# EAGLE design S205X (EAGLE 6.6.0)
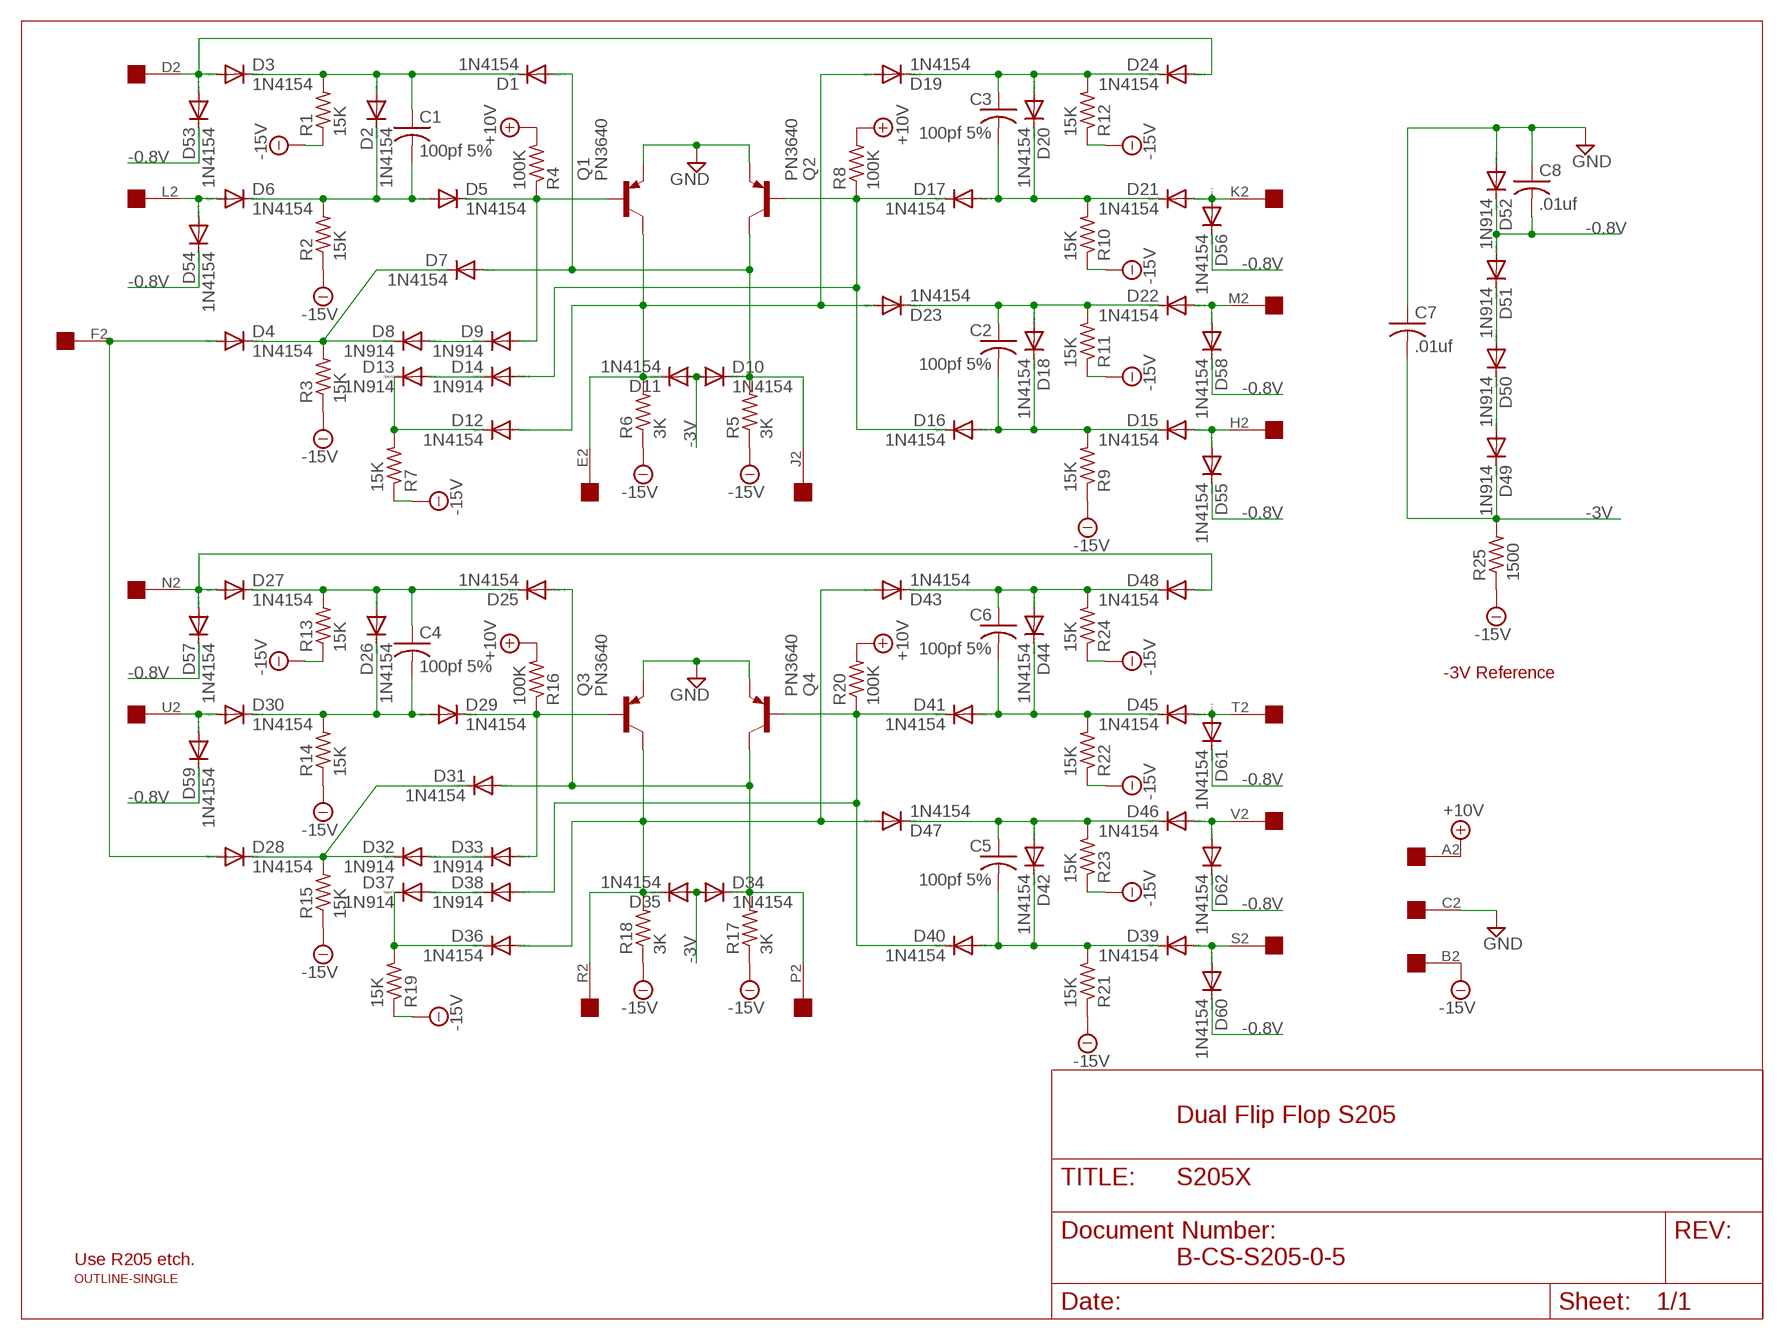
[diagram p0: schematic, sheet 1]

## Parts
C1  100pf 5%  C-US050-025X075  [C050-025X075]
C2  100pf 5%  C-US050-025X075  [C050-025X075]
C3  100pf 5%  C-US050-025X075  [C050-025X075]
C4  100pf 5%  C-US050-025X075  [C050-025X075]
C5  100pf 5%  C-US050-025X075  [C050-025X075]
C6  100pf 5%  C-US050-025X075  [C050-025X075]
C7  .01uf  C-US050-025X075  [C050-025X075]
C8  .01uf  C-US050-025X075  [C050-025X075]
D1  1N4154  1N4148DO35-10  [DO35-10]
D2  1N4154  1N4148DO35-10  [DO35-10]
D3  1N4154  1N4148DO35-10  [DO35-10]
D4  1N4154  1N4148DO35-10  [DO35-10]
D5  1N4154  1N4148DO35-10  [DO35-10]
D6  1N4154  1N4148DO35-10  [DO35-10]
D7  1N4154  1N4148DO35-10  [DO35-10]
D8  1N914  1N4148DO35-10  [DO35-10]
D9  1N914  1N4148DO35-10  [DO35-10]
D10  1N4154  1N4148DO35-10  [DO35-10]
D11  1N4154  1N4148DO35-10  [DO35-10]
D12  1N4154  1N4148DO35-10  [DO35-10]
D13  1N914  1N4148DO35-10  [DO35-10]
D14  1N914  1N4148DO35-10  [DO35-10]
D15  1N4154  1N4148DO35-10  [DO35-10]
D16  1N4154  1N4148DO35-10  [DO35-10]
D17  1N4154  1N4148DO35-10  [DO35-10]
D18  1N4154  1N4148DO35-10  [DO35-10]
D19  1N4154  1N4148DO35-10  [DO35-10]
D20  1N4154  1N4148DO35-10  [DO35-10]
D21  1N4154  1N4148DO35-10  [DO35-10]
D22  1N4154  1N4148DO35-10  [DO35-10]
D23  1N4154  1N4148DO35-10  [DO35-10]
D24  1N4154  1N4148DO35-10  [DO35-10]
D25  1N4154  1N4148DO35-10  [DO35-10]
D26  1N4154  1N4148DO35-10  [DO35-10]
D27  1N4154  1N4148DO35-10  [DO35-10]
D28  1N4154  1N4148DO35-10  [DO35-10]
D29  1N4154  1N4148DO35-10  [DO35-10]
D30  1N4154  1N4148DO35-10  [DO35-10]
D31  1N4154  1N4148DO35-10  [DO35-10]
D32  1N914  1N4148DO35-10  [DO35-10]
D33  1N914  1N4148DO35-10  [DO35-10]
D34  1N4154  1N4148DO35-10  [DO35-10]
D35  1N4154  1N4148DO35-10  [DO35-10]
D36  1N4154  1N4148DO35-10  [DO35-10]
D37  1N914  1N4148DO35-10  [DO35-10]
D38  1N914  1N4148DO35-10  [DO35-10]
D39  1N4154  1N4148DO35-10  [DO35-10]
D40  1N4154  1N4148DO35-10  [DO35-10]
D41  1N4154  1N4148DO35-10  [DO35-10]
D42  1N4154  1N4148DO35-10  [DO35-10]
D43  1N4154  1N4148DO35-10  [DO35-10]
D44  1N4154  1N4148DO35-10  [DO35-10]
D45  1N4154  1N4148DO35-10  [DO35-10]
D46  1N4154  1N4148DO35-10  [DO35-10]
D47  1N4154  1N4148DO35-10  [DO35-10]
D48  1N4154  1N4148DO35-10  [DO35-10]
D49  1N914  1N4148DO35-10  [DO35-10]
D50  1N914  1N4148DO35-10  [DO35-10]
D51  1N914  1N4148DO35-10  [DO35-10]
D52  1N914  1N4148DO35-10  [DO35-10]
D53  1N4154  1N4148DO35-10  [DO35-10]
D54  1N4154  1N4148DO35-10  [DO35-10]
D55  1N4154  1N4148DO35-10  [DO35-10]
D56  1N4154  1N4148DO35-10  [DO35-10]
D57  1N4154  1N4148DO35-10  [DO35-10]
D58  1N4154  1N4148DO35-10  [DO35-10]
D59  1N4154  1N4148DO35-10  [DO35-10]
D60  1N4154  1N4148DO35-10  [DO35-10]
D61  1N4154  1N4148DO35-10  [DO35-10]
D62  1N4154  1N4148DO35-10  [DO35-10]
Q1  PN3640  2N3637  [TO39]
Q2  PN3640  2N3637  [TO39]
Q3  PN3640  2N3637  [TO39]
Q4  PN3640  2N3637  [TO39]
R1  15K  R-US_0207/10  [0207/10]
R2  15K  R-US_0207/10  [0207/10]
R3  15K  R-US_0207/10  [0207/10]
R4  100K  R-US_0207/10  [0207/10]
R5  3K  R-US_0207/10  [0207/10]
R6  3K  R-US_0207/10  [0207/10]
R7  15K  R-US_0207/10  [0207/10]
R8  100K  R-US_0207/10  [0207/10]
R9  15K  R-US_0207/10  [0207/10]
R10  15K  R-US_0207/10  [0207/10]
R11  15K  R-US_0207/10  [0207/10]
R12  15K  R-US_0207/10  [0207/10]
R13  15K  R-US_0207/10  [0207/10]
R14  15K  R-US_0207/10  [0207/10]
R15  15K  R-US_0207/10  [0207/10]
R16  100K  R-US_0207/10  [0207/10]
R17  3K  R-US_0207/10  [0207/10]
R18  3K  R-US_0207/10  [0207/10]
R19  15K  R-US_0207/10  [0207/10]
R20  100K  R-US_0207/10  [0207/10]
R21  15K  R-US_0207/10  [0207/10]
R22  15K  R-US_0207/10  [0207/10]
R23  15K  R-US_0207/10  [0207/10]
R24  15K  R-US_0207/10  [0207/10]
R25  1500  R-US_0207/10  [0207/10]
U$1  OUTLINE-SINGLE  [SINGLE]
U$2  EDGE-1  [EDGE-CON1]

## Nets
+10V [Power]: R4.2 R8.2 R16.2 R20.2 U$2.A2
-0.8V [Power]: C8.2 D51.A D52.C D53.C D54.C D55.C D56.C D57.C D58.C D59.C D60.C D61.C D62.C
-3V [Power]: C7.2 D10.A D11.A D34.A D35.A D49.C R25.2
-15V [Power]: R1.1 R2.1 R3.1 R5.1 R6.1 R7.1 R9.1 R10.1 R11.1 R12.1 R13.1 R14.1 R15.1 R17.1 R18.1 R19.1 R21.1 R22.1 R23.1 R24.1 R25.1 U$2.B2
E: D11.C D12.A D19.A D23.A Q1.3(C) R6.2 U$2.E2
GND [Power]: C7.1 C8.1 D52.A Q1.1(E) Q2.1(E) Q3.1(E) Q4.1(E) U$2.C2
J: D1.A D7.A D10.C Q2.3(C) R5.2 U$2.J2
N$1: C4.1 D25.C D26.A D27.C R13.2
N$2: C3.1 D19.C D20.A D24.C R12.2
N$3: C1.2 D2.C D5.A D6.C R2.2
N$4: D3.A D24.A D53.A U$2.D2
N$5: D6.A D54.A U$2.L2
N$6: D13.A D14.C
N$7: D32.A D33.C
N$8: C3.2 D17.A D20.C D21.C R10.2
N$9: D4.C D7.C D8.C R3.2
N$10: D4.A D28.A U$2.F2
N$11: D21.A D56.A U$2.K2
N$12: D12.C D13.C R7.2
N$13: D50.A D51.C
N$14: D5.C D9.A Q1.2(B) R4.1
N$15: C4.2 D26.C D29.A D30.C R14.2
N$16: D49.A D50.C
N$17: D14.A D16.C D17.C Q2.2(B) R8.1
N$18: D30.A D59.A U$2.U2
N$19: D28.C D31.C D32.C R15.2
N$21: D29.C D33.A Q3.2(B) R16.1
N$22: C1.1 D1.C D2.A D3.C R1.2
N$23: D8.A D9.C
N$24: C6.1 D43.C D44.A D48.C R24.2
N$25: D37.A D38.C
N$26: C6.2 D41.A D44.C D45.C R22.2
N$27: D45.A D61.A U$2.T2
N$28: C2.1 D18.A D22.C D23.C R11.2
N$29: D38.A D40.C D41.C Q4.2(B) R20.1
N$30: D22.A D58.A U$2.M2
N$31: C2.2 D15.C D16.A D18.C R9.2
N$32: D15.A D55.A U$2.H2
N$33: D36.C D37.C R19.2
N$34: C5.1 D42.A D46.C D47.C R23.2
N$35: D46.A D62.A U$2.V2
N$36: C5.2 D39.C D40.A D42.C R21.2
N$37: D39.A D60.A U$2.S2
N$38: D27.A D48.A D57.A U$2.N2
P: D25.A D31.A D34.C Q4.3(C) R17.2 U$2.P2
R: D35.C D36.A D43.A D47.A Q3.3(C) R18.2 U$2.R2

## Notes on the sheet
- -3V Reference
- Dual Flip Flop S205
- Use R205 etch. | B-CS-S205-0-5

## Library data of the parts
C1-C8 = rcl:C-US: CAPACITOR, American symbol
D1-D62 = diode:1N4148: DIODE high speed (Philips)
Q1-Q4 = transistor-pnp:2N3637*: PNP Transistror
R1-R25 = rcl:R-US_: RESISTOR, American symbol
U$1 = dec-con:OUTLINE-*: Board outlines for DEC boards.
U$2 = dec-con:EDGE-1: Single-Sided DEC Edge Connector -- (side 2)

## Net classes
1 Power: width 0.813 mm

## Board
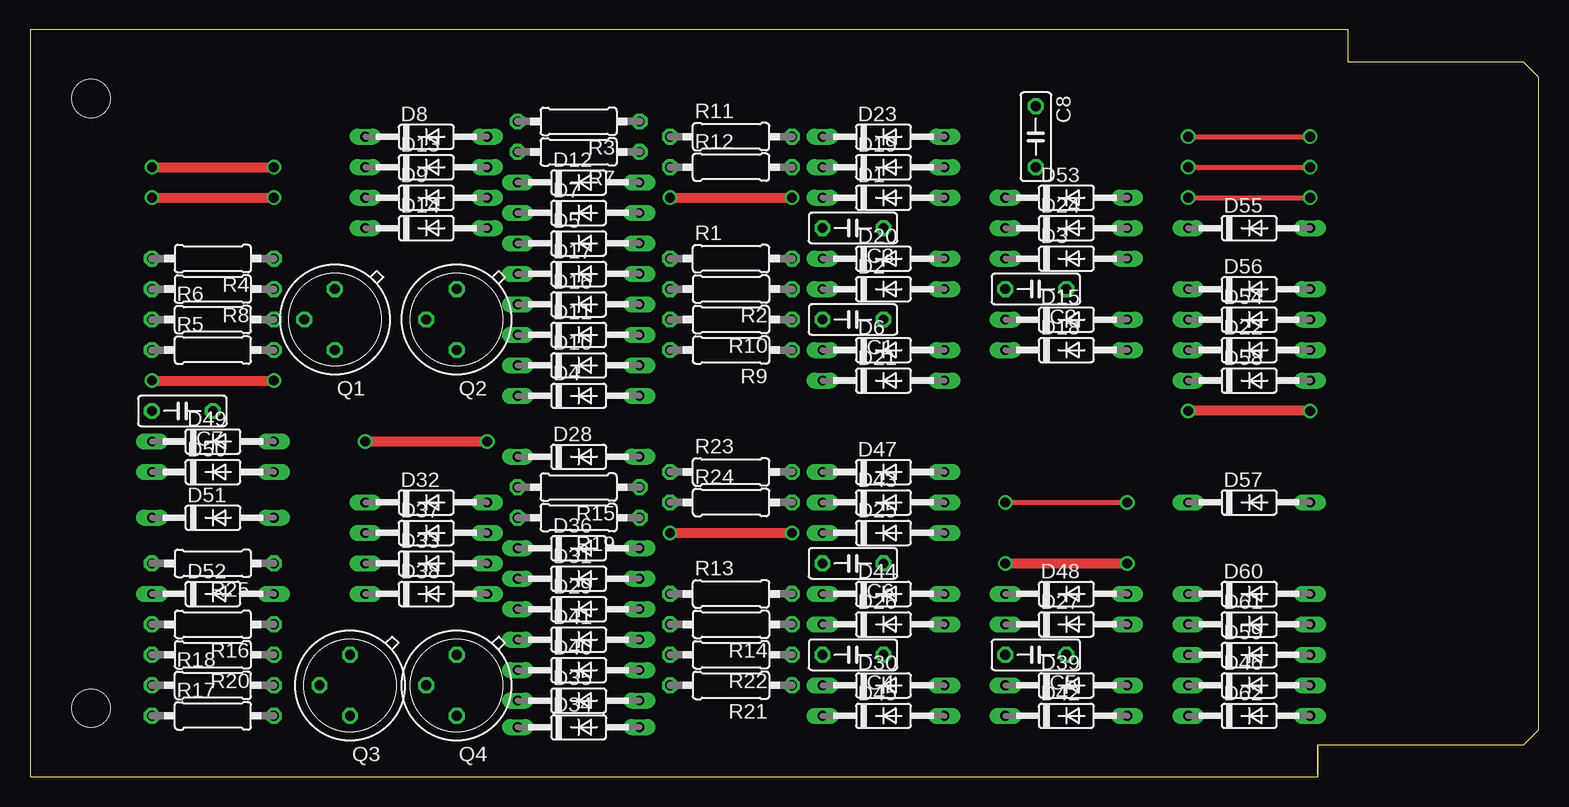
[diagram p1: board, top side]
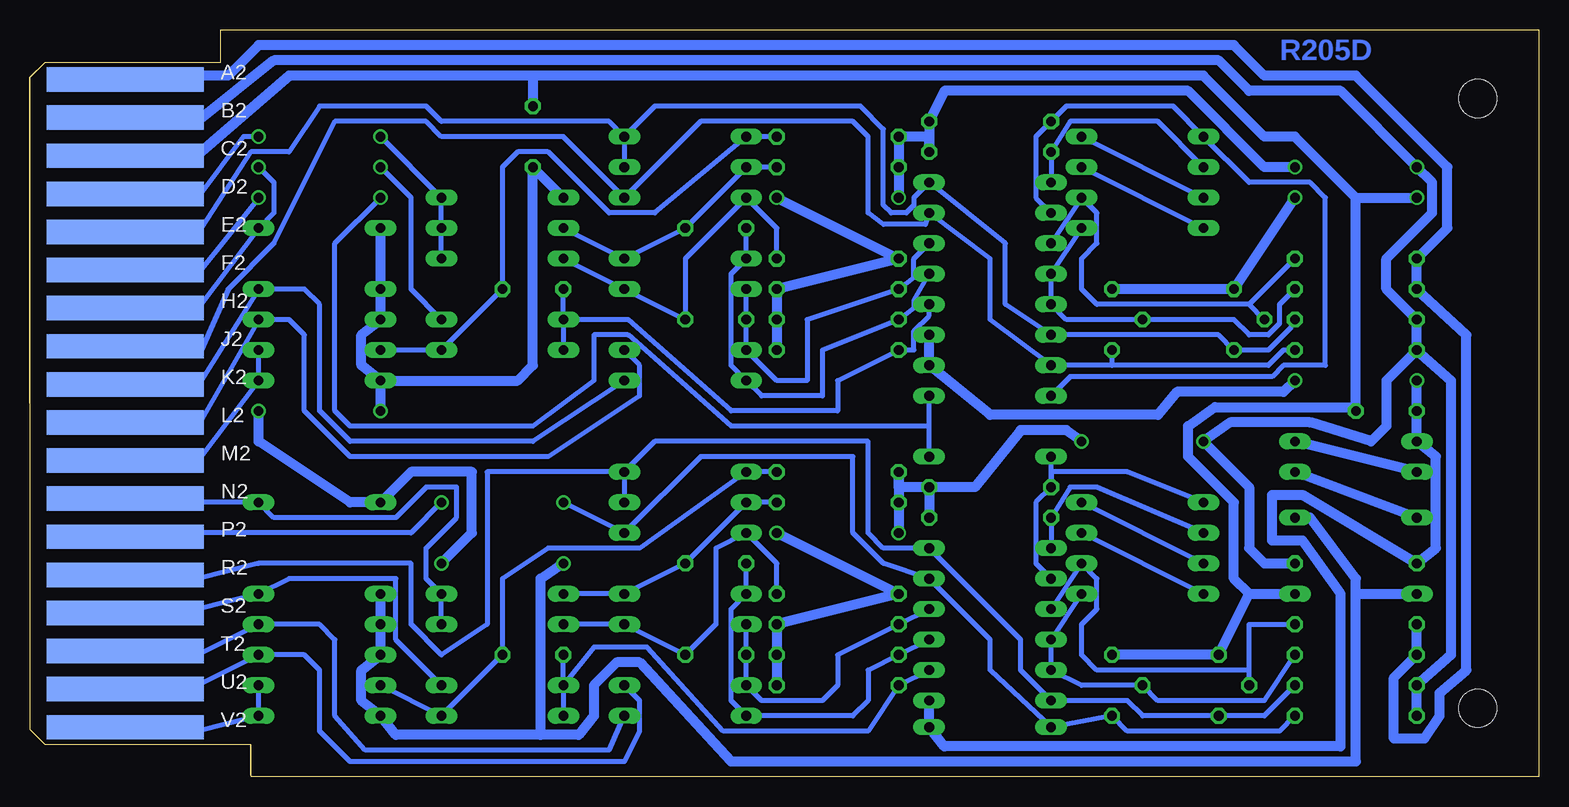
[diagram p2: board, bottom side, seen from below]

Size 125.73 x 62.23 mm. Coordinates in mm from the lower left corner, seen from the top.
Copper layers (1+16): Top 0.035mm / dielectric 1.5mm / Bottom 0.035mm
Design rules "16mils": minimum track width 16mil, minimum drill 32mil, track to track 15mil, track to pad 10mil, pad to pad 10mil, via to via 10mil, smd to smd 10mil, copper to edge 13mil, drill to drill 10mil, minimum pad ring 10mil, minimum via ring 8mil, stop-mask expansion 0mil, vias tented up to drill 0mil, thermal gap 10mil

### Footprints (pad centres in the part's own frame; a part is rotated, then mirrored left to right if it is on the bottom)
C050-025X075 = drill 0.813 octagon: 1 -2.54,0; 2 2.54,0
DO35-10 = drill 0.813 long: A 5.08,0; C -5.08,0
TO39 = drill 0.813 octagon: 1 0,-2.54; 2 2.54,0; 3 0,2.54
0207/10 = drill 0.813 octagon: 1 -5.08,0; 2 5.08,0
SINGLE = hole 3.175: 120.65,56.515; 120.65,5.715
EDGE-CON1 = smd 13.106 x 2.032 bottom: A2 7.938,4.128; B2 7.938,7.303; C2 7.938,10.477; D2 7.938,13.652; E2 7.938,16.828; F2 7.938,20.003; H2 7.938,23.177; J2 7.938,26.352; K2 7.938,29.527; L2 7.938,32.703; M2 7.938,35.877; N2 7.938,39.053; P2 7.938,42.227; R2 7.938,45.403; S2 7.938,48.578; T2 7.938,51.752; U2 7.938,54.928; V2 7.938,58.102

### Placement (x,y rotation side)
C1  68.58,38.1 180 top
C2  83.82,40.64 180 top
C3  68.58,45.72 180 top
C4  68.58,10.16 180 top
C5  83.82,10.16 180 top
C6  68.58,17.78 180 top
C7  12.7,30.48 180 top
C8  83.82,53.34 270 top
D1  71.12,48.26 0 top
D2  71.12,40.64 0 top
D3  86.36,43.18 0 top
D4  45.72,31.75 0 top
D5  45.72,44.45 0 top
D6  71.12,35.56 0 top
D7  45.72,46.99 0 top
D8  33.02,53.34 0 top
D9  33.02,48.26 0 top
D10  45.72,34.29 0 top
D11  45.72,36.83 0 top
D12  45.72,49.53 0 top
D13  33.02,50.8 0 top
D14  33.02,45.72 0 top
D15  86.36,38.1 0 top
D16  45.72,39.37 0 top
D17  45.72,41.91 0 top
D18  86.36,35.56 0 top
D19  71.12,50.8 0 top
D20  71.12,43.18 0 top
D21  71.12,33.02 0 top
D22  101.6,35.56 0 top
D23  71.12,53.34 0 top
D24  86.36,45.72 0 top
D25  71.12,20.32 0 top
D26  71.12,12.7 0 top
D27  86.36,12.7 0 top
D28  45.72,26.67 0 top
D29  45.72,13.97 0 top
D30  71.12,7.62 0 top
D31  45.72,16.51 0 top
D32  33.02,22.86 0 top
D33  33.02,17.78 0 top
D34  45.72,4.13 0 top
D35  45.72,6.35 0 top
D36  45.72,19.05 0 top
D37  33.02,20.32 0 top
D38  33.02,15.24 0 top
D39  86.36,7.62 0 top
D40  45.72,8.89 0 top
D41  45.72,11.43 0 top
D42  86.36,5.08 0 top
D43  71.12,22.86 0 top
D44  71.12,15.24 0 top
D45  71.12,5.08 0 top
D46  101.6,7.62 0 top
D47  71.12,25.4 0 top
D48  86.36,15.24 0 top
D49  15.24,27.94 0 top
D50  15.24,25.4 0 top
D51  15.24,21.59 0 top
D52  15.24,15.24 0 top
D53  86.36,48.26 0 top
D54  101.6,38.1 0 top
D55  101.6,45.72 0 top
D56  101.6,40.64 0 top
D57  101.6,22.86 0 top
D58  101.6,33.02 0 top
D59  101.6,10.16 0 top
D60  101.6,15.24 0 top
D61  101.6,12.7 0 top
D62  101.6,5.08 0 top
Q1  25.4,38.1 180 top
Q2  35.56,38.1 180 top
Q3  26.67,7.62 180 top
Q4  35.56,7.62 180 top
R1  58.42,43.18 0 top
R2  58.42,40.64 180 top
R3  45.72,54.61 180 top
R4  15.24,43.18 180 top
R5  15.24,35.56 0 top
R6  15.24,38.1 0 top
R7  45.72,52.07 180 top
R8  15.24,40.64 180 top
R9  58.42,35.56 180 top
R10  58.42,38.1 180 top
R11  58.42,53.34 0 top
R12  58.42,50.8 0 top
R13  58.42,15.24 0 top
R14  58.42,12.7 180 top
R15  45.72,24.13 180 top
R16  15.24,12.7 180 top
R17  15.24,5.08 0 top
R18  15.24,7.62 0 top
R19  45.72,21.59 180 top
R20  15.24,10.16 180 top
R21  58.42,7.62 180 top
R22  58.42,10.16 180 top
R23  58.42,25.4 0 top
R24  58.42,22.86 0 top
R25  15.24,17.78 180 top
U$1  125.73,62.23 180 top
U$2  125.73,62.23 180 top

### Tracks (layer width: path | path; a pad name or v marks a point on that pad's centre or on a via)
+10V
  Bottom 0.813: R16.2 R20.2 12.06,8.26 12.06,3.17 9.53,3.17 8.26,5.08 8.26,6.99 6.03,8.89 6.03,36.83 R8.2 R4.2 7.62,45.72 7.62,50.8 15.24,58.42 22.86,58.42 25.4,60.96 106.68,60.96 109.22,58.42 111.76,58.42 U$2.A2
-0.8V  (via drill 0.81)
  Top 0.813: v81.28,17.78 v91.44,17.78 | v106.68,30.48 v96.52,30.48
  Bottom 0.813: D60.C D61.C D59.C 98.11,8.89 98.11,6.35 D62.C 95.25,3.49 83.19,3.49 | 83.19,3.49 80.01,3.49 78.74,5.08 78.74,7.62 76.83,9.53 74.93,9.53 67.31,1.27 15.24,1.27 15.24,15.24 | v91.44,17.78 88.9,20.32 88.9,25.4 93.98,25.4 D57.C 99.06,22.86 106.68,27.94 v106.68,30.48 | 83.19,3.49 83.19,16.51 v81.28,17.78 | 15.24,15.24 D52.C | D51.A 19.05,21.59 15.24,16.51 15.24,15.24 | D53.C C8.2 83.82,34.29 85.09,33.02 D58.C | v96.52,30.48 D58.C | D58.C 98.11,34.29 98.11,36.83 D54.C D56.C D55.C
-3V  (via drill 0.81)
  Top 0.813: v10.16,33.02 v20.32,33.02
  Bottom 0.813: D35.A D34.A 49.53,2.54 16.51,2.54 16.51,15.24 19.68,19.68 22.23,19.68 22.23,23.5 19.68,23.5 R25.2 8.57,19.05 8.57,26.67 D49.C C7.2 v10.16,33.02 | D11.A D10.A 45.72,30.16 31.75,30.16 30.16,32.07 21.27,32.07 v20.32,33.02
-15V  (via drill 0.81)
  Top 0.813: v53.34,20.32 v63.5,20.32 | v27.94,27.94 v38.1,27.94 | v10.16,50.8 v20.32,50.8 | v53.34,48.26 v63.5,48.26
  Bottom 0.813: R21.1 R22.1 R14.1 R13.1 v63.5,20.32 | v53.34,20.32 R24.1 R23.1 53.34,24.13 R15.1 | R15.1 R19.1 | R17.1 R18.1 7.3,10.16 7.3,33.02 R5.1 | R15.1 46.99,24.13 43.18,28.89 39.37,28.89 v38.1,27.94 | R25.1 22.86,17.78 24.13,19.05 24.13,24.13 v27.94,27.94 25.72,29.53 19.05,29.53 13.97,27.94 12.7,29.21 12.7,33.02 R5.1 | U$2.B2 111.76,54.61 105.41,59.69 26.67,59.69 24.13,57.15 16.51,57.15 v10.16,50.8 8.89,49.53 8.89,46.99 12.7,43.18 12.7,40.64 R6.1 R5.1 | v53.34,48.26 R12.1 R11.1 50.8,53.34 R7.1 R3.1 49.53,57.15 29.21,57.15 22.86,50.8 v20.32,50.8 | v63.5,48.26 R1.1 R2.1 R10.1 R9.1
E
  Bottom 0.406: U$2.E2 111.44,45.72 107.31,52.07 104.14,52.07 101.6,55.88 92.71,55.88 91.44,54.61 77.47,54.61 D23.A | D23.A D19.A | D23.A 73.66,55.88 56.52,55.88 54.61,53.98 54.61,47.62 53.98,46.99 52.7,46.99 52.07,47.62 52.07,48.26 D12.A 44.45,44.45 44.45,39.37 D11.C 26.67,36.83 Q1.3 22.54,35.56 20.64,37.47 20.64,38.1 R6.2
GND  (via drill 0.81)
  Top 0.813: v10.16,48.26 v20.32,48.26
  Bottom 0.813: 24.13,15.24 D52.A | 24.13,15.24 Q3.1 Q4.1 | U$2.C2 111.44,52.07 104.14,58.42 83.82,58.42 | 83.82,58.42 27.94,58.42 22.86,53.34 20.32,53.34 15.24,48.26 | 83.82,58.42 C8.1 | 24.13,15.24 25.4,16.51 25.4,22.86 29.21,26.67 29.21,29.21 26.99,30.8 15.24,30.8 C7.1 15.24,48.26 | 15.24,48.26 v10.16,48.26 | Q2.1 Q1.1 v20.32,48.26
J
  Bottom 0.406: U$2.J2 111.44,35.56 109.22,40.64 105.41,44.45 100.33,54.61 92.71,54.61 91.44,53.34 81.28,53.34 D1.A 69.85,54.61 57.15,54.61 55.88,53.34 55.88,46.99 54.61,46.04 51.12,46.04 D7.A 45.72,43.18 45.72,38.1 D10.C 35.56,34.29 | R5.2 21.27,35.56 22.54,34.29 35.56,34.29 | 35.56,34.29 Q2.3
N$1
  Bottom 0.406: D27.C D26.A C4.1 68.58,12.7 68.58,19.05 D25.C 63.5,17.78 R13.2
N$2
  Bottom 0.406: D24.C D20.A C3.1 D19.C R12.2
N$3
  Bottom 0.406: D2.C C1.2 D6.C 63.5,33.02 60.96,33.02 60.96,38.1 R2.2 52.07,41.59 52.07,43.18 D5.A
N$4  (via drill 0.81)
  Top 0.406: v96.52,53.34 v106.68,53.34
  Bottom 0.406: U$2.D2 111.76,48.26 107.95,53.34 v106.68,53.34 | v96.52,53.34 D53.A D24.A D3.A
N$5
  Bottom 0.406: U$2.L2 111.76,29.21 D54.A 104.14,38.1 102.87,36.83 102.87,30.48 99.06,26.67 82.55,26.67 74.93,31.75 74.93,34.29 D6.A
N$6
  Bottom 0.406: D14.C D13.A
N$7
  Bottom 0.406: D33.C D32.A
N$8
  Bottom 0.406: C3.2 D20.C 67.31,41.91 67.31,34.29 D21.C 64.77,31.75 59.69,31.75 59.69,35.56 R10.2 52.07,39.05 52.07,39.69 D17.A
N$9
  Bottom 0.406: D7.C 41.91,48.26 41.91,53.34 R3.2 39.37,55.88 30.48,55.88 D8.C 24.13,49.53 19.05,49.53 17.78,48.26 17.78,34.29 21.27,34.29 22.23,33.34 39.05,33.34 D4.C
N$10  (via drill 0.81)
  Top 0.406: v96.52,48.26 v106.68,48.26
  Bottom 0.406: U$2.F2 111.76,41.91 v106.68,48.26 | v96.52,48.26 100.33,44.45 100.33,30.48 99.06,29.21 83.82,29.21 78.74,33.02 78.74,36.83 75.88,36.83 67.31,29.21 50.8,29.21 | D28.A 50.8,29.21 | 50.8,29.21 D4.A
N$11
  Bottom 0.406: U$2.K2 111.44,33.02 D56.A 102.87,40.64 101.6,39.37 101.6,30.48 99.06,27.94 83.82,27.94 D21.A
N$12
  Bottom 0.406: D13.C 31.75,54.61 39.05,54.61 R7.2 D12.C
N$13
  Bottom 0.813: D51.C D50.A
N$14
  Bottom 0.406: D5.C D9.A 36.83,46.99 36.83,44.45 38.1,43.18 38.1,40.64 36.83,39.37 24.13,39.37 | Q1.2 24.13,39.37 | 24.13,39.37 R4.1
N$15
  Bottom 0.406: D26.C C4.2 D30.C 64.77,6.35 59.69,6.35 58.42,7.62 58.42,10.16 R14.2 D29.A
N$16
  Bottom 0.813: D50.C D49.A
N$17
  Bottom 0.406: D14.A D17.C D16.C 39.37,38.1 Q2.2 25.4,38.1 24.13,36.83 22.54,36.83 21.59,37.78 21.59,39.37 R8.1
N$18
  Bottom 0.406: U$2.U2 111.76,7.62 D59.A 102.87,10.16 101.6,8.89 101.6,3.81 99.06,1.27 76.2,1.27 74.93,3.81 74.93,6.35 D30.A
N$19
  Bottom 0.406: D31.C 41.91,17.78 41.91,22.86 R15.2 | D32.C 34.29,25.4 40.64,25.4 R15.2 | R15.2 D28.C
N$21
  Bottom 0.406: 24.13,8.89 24.13,12.7 R16.1 | Q3.2 24.13,8.89 | 24.13,8.89 36.83,8.89 38.1,10.16 38.1,12.7 36.83,13.97 36.83,16.51 D33.A D29.C
N$22
  Bottom 0.406: D3.C D2.A C1.1 71.12,43.18 D1.C 63.5,45.72 R1.2
N$23
  Bottom 0.406: D9.C D8.A
N$24
  Bottom 0.406: D48.C D44.A C6.1 D43.C R24.2
N$25
  Bottom 0.406: D38.C D37.A
N$26
  Bottom 0.406: C6.2 D44.C 67.31,13.97 67.31,6.35 D45.C 57.15,5.08 55.88,6.35 55.88,8.89 R22.2 D41.A
N$27
  Bottom 0.406: U$2.T2 111.76,10.16 D61.A 101.6,12.7 100.33,11.43 100.33,5.08 97.79,2.22 77.47,2.22 D45.A
N$28
  Bottom 0.406: D22.C D18.A C2.1 86.36,50.8 85.09,52.07 82.55,52.07 77.47,46.99 73.66,46.99 D23.C R11.2
N$29
  Bottom 0.406: R20.1 22.86,6.35 31.75,6.35 Q4.2 38.1,7.62 D40.C D41.C D38.A
N$30
  Bottom 0.406: U$2.M2 111.44,26.67 D58.A D22.A
N$31
  Bottom 0.406: D15.C D18.C | D15.C C2.2 | D15.C 75.88,38.1 67.31,30.48 58.42,30.48 58.42,33.02 R9.2 52.07,35.56 52.07,37.15 50.8,38.42 D16.A
N$32  (via drill 0.81)
  Top 0.406: v96.52,50.8 v106.68,50.8
  Bottom 0.406: U$2.H2 111.44,39.37 D55.A 105.41,46.99 105.41,49.53 v106.68,50.8 | D15.A 93.98,40.64 93.98,48.26 v96.52,50.8
N$33
  Bottom 0.406: D37.C 36.83,24.13 39.05,24.13 R19.2 D36.C
N$34
  Bottom 0.406: D46.C D42.A C5.1 86.36,16.51 82.55,19.05 74.93,19.05 D47.C R23.2
N$35
  Bottom 0.406: U$2.V2 111.76,4.13 111.76,3.81 D62.A D46.A
N$36
  Bottom 0.406: D39.C C5.2 | D39.C D42.C | D39.C 78.74,10.79 74.3,10.79 67.94,3.81 55.88,3.81 R21.2 D40.A
N$37
  Bottom 0.406: U$2.S2 111.76,13.97 D60.A 104.14,16.51 95.25,16.51 95.25,11.43 D39.A
N$38
  Bottom 0.406: U$2.N2 111.76,22.86 D57.A 105.41,21.59 95.25,21.59 92.71,24.13 90.17,24.13 90.17,21.59 92.71,19.05 92.71,16.51 D48.A D27.A
P  (via drill 0.81)
  Top 0.406: v81.28,22.86 v91.44,22.86
  Bottom 0.406: U$2.P2 111.76,20.32 93.98,20.32 v91.44,22.86 | v81.28,22.86 D25.A 69.85,26.67 57.15,26.67 57.15,20.32 54.61,17.78 D31.A 45.72,11.43 45.72,8.89 D34.C Q4.3 34.29,3.81 21.59,3.81 R17.2
R
  Bottom 0.406: U$2.R2 111.76,16.51 106.68,17.78 93.98,17.78 93.98,12.7 91.44,10.16 87.63,12.7 87.63,25.4 D47.A | D47.A D43.A | D47.A 73.66,27.94 55.88,27.94 55.88,20.32 54.61,19.05 D36.A 43.18,11.43 43.18,8.89 D35.C 34.29,6.35 33.02,5.08 Q3.3 22.86,5.08 R18.2

### Text on the board
Bottom: R205D